# EAGLE schematic PWM sheild d1 mini v1 (EAGLE 9.6.2)
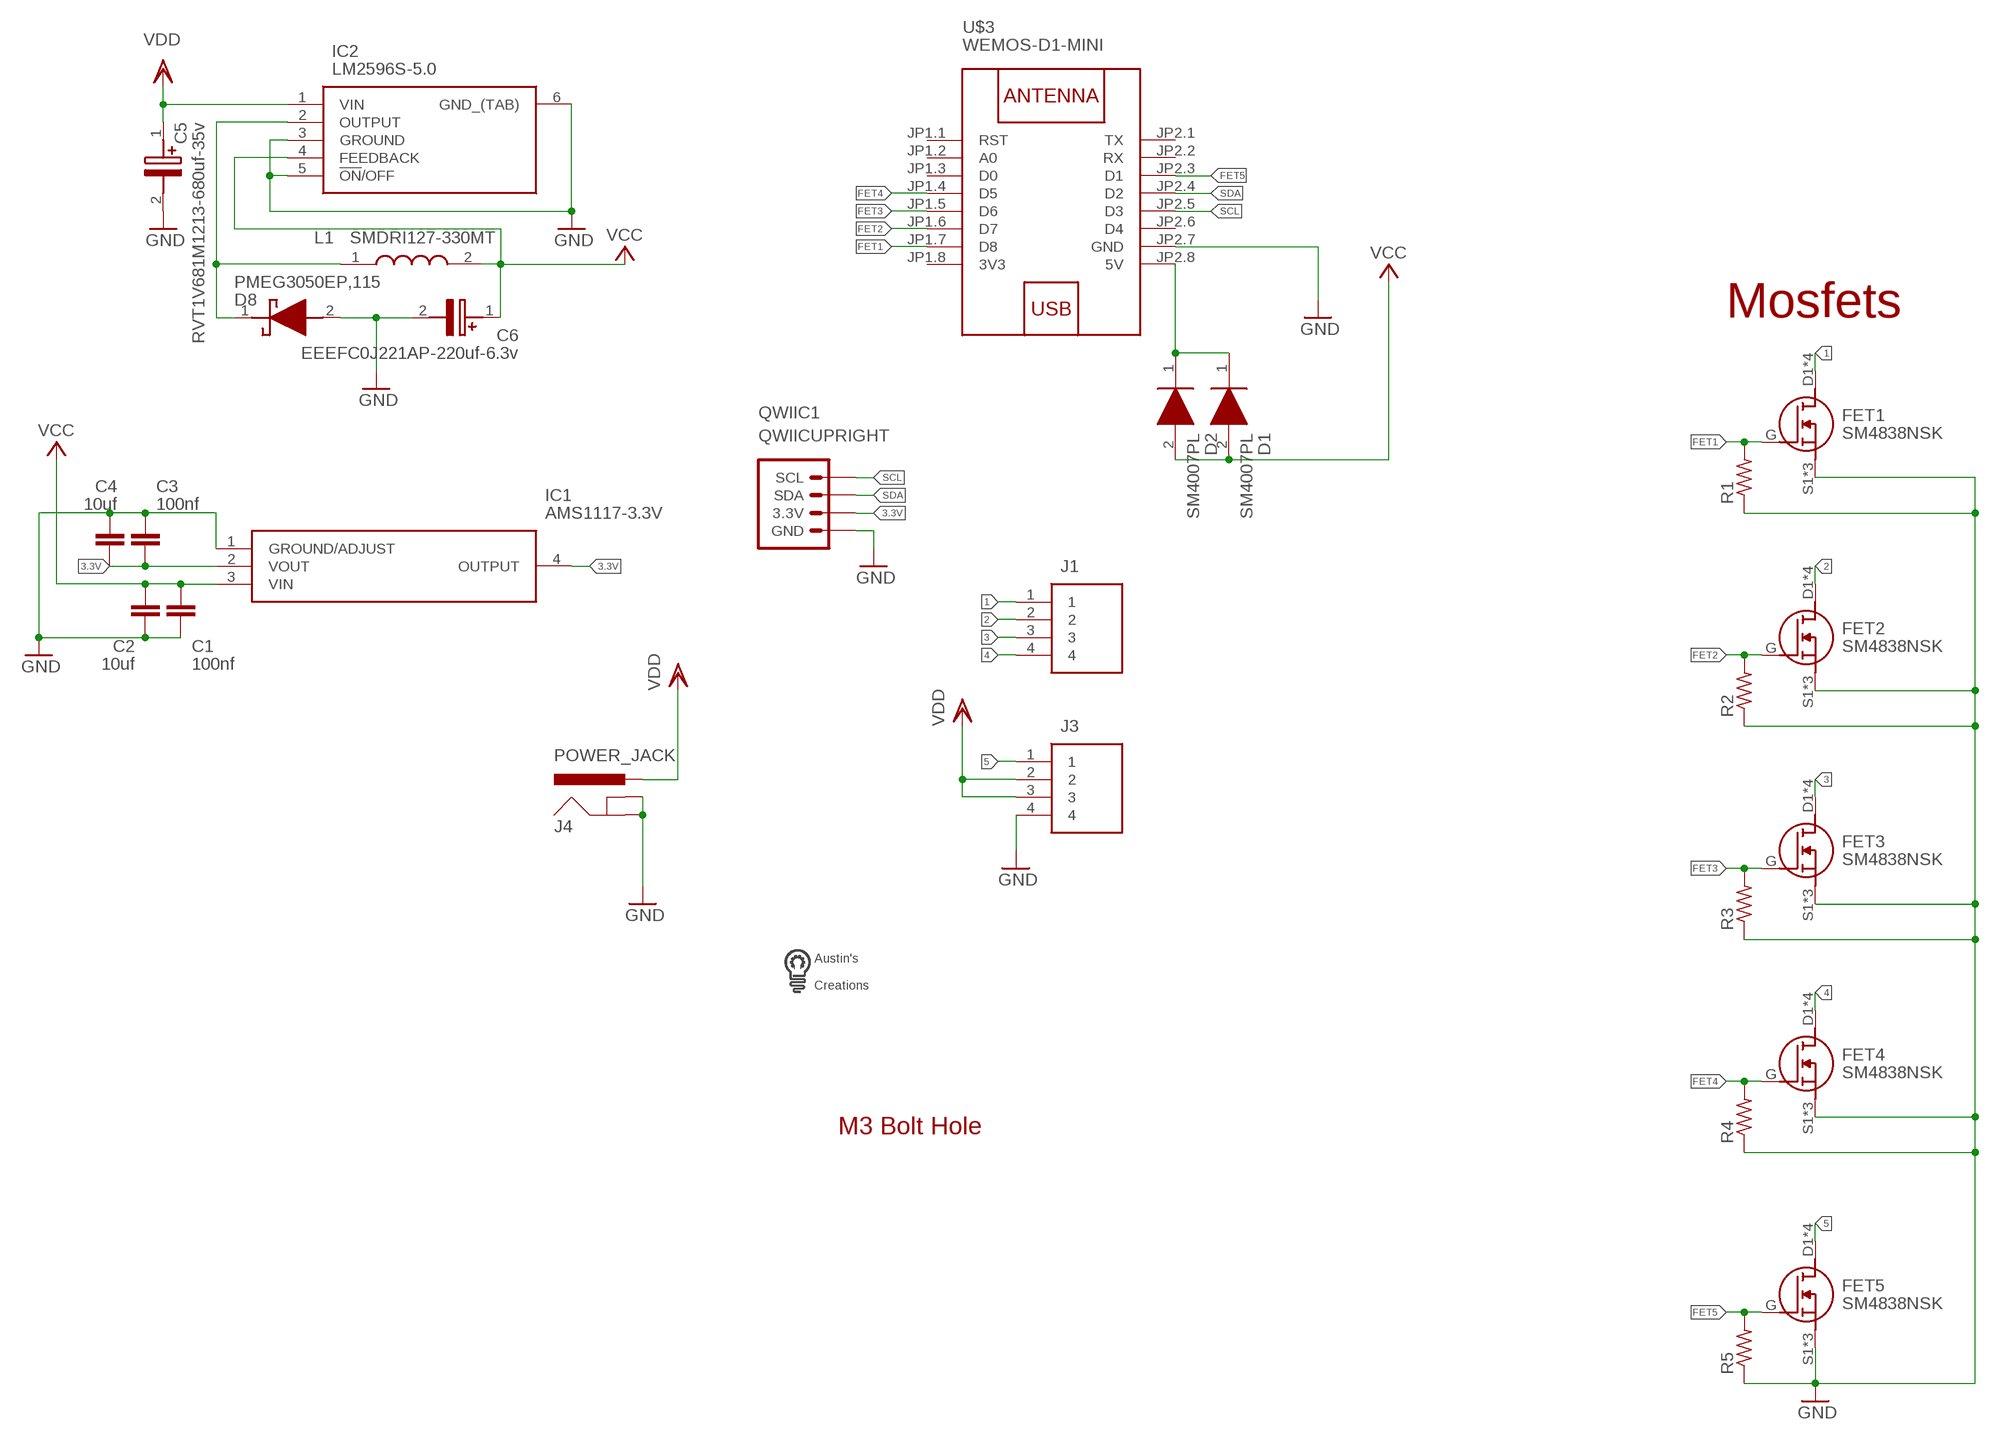
[diagram p0: schematic, sheet 1]

## Parts
C1  100nf  C-EUC0603  [C0603]
C2  10uf  C-EUC0603  [C0603]
C3  100nf  C-EUC0603  [C0603]
C4  10uf  C-EUC0603  [C0603]
C5  RVT1V681M1213-680uf-35v  EEE-HD1V681AQ  [CAPAE1350X1400N]
C6  EEEFC0J221AP-220uf-6.3v  EEEFC0J221AP  [CAPAE830X650N]
D1  SM4007PL  [SODFL3718X125N]
D2  SM4007PL  [SODFL3718X125N]
D8  PMEG3050EP,115  [PMEG3050EP115]
FET1  SM4838NSK  [SM4838NSK]
FET2  SM4838NSK  [SM4838NSK]
FET3  SM4838NSK  [SM4838NSK]
FET4  SM4838NSK  [SM4838NSK]
FET5  SM4838NSK  [SM4838NSK]
IC1  AMS1117-3.3V  [SOT229P700X180-4N]
IC2  LM2596S-5.0  LM2596S-3.3_NOPB  [TO170P1435X465-6N]
J1  SCREWTERMINAL-4P-5MM  [SCREWTERMINAL-4P-5MM]
J3  SCREWTERMINAL-4P-5MM  [SCREWTERMINAL-4P-5MM]
J4  POWER_JACK  [POWER_JACK_PTH]
L1  SMDRI127-330MT  CDRH127_LDNP-330MC  [INDPM120120X800N]
QWIIC1  QWIICUPRIGHT  [BM04B-SRSS-TB]
R1  R-US_R0603  [R0603]
R2  R-US_R0603  [R0603]
R3  R-US_R0603  [R0603]
R4  R-US_R0603  [R0603]
R5  R-US_R0603  [R0603]
U$1  M3BOLTHOLE  [M3BOLTHOLE]
U$3  WEMOS-D1-MINI  [WEMOS-D1-MINI]
U$4  LOGOMED  [LOGOMED]

## Nets
1: FET1.D1(D) FET1.D2(D) FET1.D3(D) FET1.D4(D) J1.1
2: FET2.D1(D) FET2.D2(D) FET2.D3(D) FET2.D4(D) J1.2
3: FET3.D1(D) FET3.D2(D) FET3.D3(D) FET3.D4(D) J1.3
3.3V: C3.2 C4.2 IC1.2(VOUT) IC1.4(OUTPUT) QWIIC1.2(3.3V)
4: FET4.D1(D) FET4.D2(D) FET4.D3(D) FET4.D4(D) J1.4
5: FET5.D1(D) FET5.D2(D) FET5.D3(D) FET5.D4(D) J3.1
FET1: FET1.G R1.2 U$3.JP1.7(D8)
FET2: FET2.G R2.2 U$3.JP1.6(D7)
FET3: FET3.G R3.2 U$3.JP1.5(D6)
FET4: FET4.G R4.2 U$3.JP1.4(D5)
FET5: FET5.G R5.2 U$3.JP2.3(D1)
GND: C1.2 C2.2 C3.1 C4.1 C5.2(-) C6.2(-) D8.2(A) FET1.S1(S) FET1.S2(S) FET1.S3(S) FET2.S1(S) FET2.S2(S) FET2.S3(S) FET3.S1(S) FET3.S2(S) FET3.S3(S) FET4.S1(S) FET4.S2(S) FET4.S3(S) FET5.S1(S) FET5.S2(S) FET5.S3(S) IC1.1(GROUND/ADJUST) IC2.3(GROUND) IC2.5(!ON!/OFF) IC2.6(GND_(TAB)) J3.4 J4.GND J4.GNDBREAK QWIIC1.1(GND) R1.1 R2.1 R3.1 R4.1 R5.1 U$3.JP2.7(GND)
N$2: D1.1(K) D2.1(K) U$3.JP2.8(5V)
N$20: D8.1(K) IC2.2(OUTPUT) L1.1
SCL: QWIIC1.4(SCL) U$3.JP2.5(D3)
SDA: QWIIC1.3(SDA) U$3.JP2.4(D2)
VCC: C1.1 C2.1 C6.1(+) D1.2(A) D2.2(A) IC1.3(VIN) IC2.4(FEEDBACK) L1.2
VDD: C5.1(+) IC2.1(VIN) J3.2 J3.3 J4.PWR
Unconnected: U$3.JP1.1(RST) U$3.JP1.2(A0) U$3.JP1.3(D0) U$3.JP2.1(TX) U$3.JP2.2(RX) U$3.JP2.6(D4)

## Notes on the sheet
- Mosfets

## Power pins joined to a net without a drawn wire
3V3: U$3.JP1.8(3V3)

## Library data of the parts
C1-C4 = rcl:C-EU: CAPACITOR, European symbol; SPICEPREFIX: C
C5 = SamacSys_Parts:EEE-HD1V681AQ: Aluminium Electrolytic Capacitors - SMD 35VDC 680uF 20% AEC-Q200 Source: Datasheet <https://industrial.panasonic.com/cdbs/www-data/pdf/RDE0000/ABA0000C1166.pdf>; DESCRIPTION: Aluminium Electrolytic Capacitors - SMD 35VDC 680uF 20% AEC-Q200; HEIGHT: 14mm; MANUFACTURER_NAME: Panasonic; MANUFACTURER_PART_NUMBER: EEE-HD1V681AQ; MOUSER_PART_NUMBER: 667-EEE-HD1V681AQ; MOUSER_PRICE-STOCK: https://www.mouser.co.uk/ProductDetail/Panasonic/EEE-HD1V681AQ?qs=w%2Fv1CP2dgqoW7i2Hoqi%252B9w%3D%3D
C6 = SamacSys_Parts:EEEFC0J221AP: PANASONIC - EEEFC0J221AP - SMD Aluminium Electrolytic Capacitor, Radial Can - SMD, 220 F, 6.3 V, EEEFC Series Source: Datasheet <https://industrial.panasonic.com/cdbs/www-data/pdf/RDE0000/ABA0000C1169.pdf>; DESCRIPTION: PANASONIC - EEEFC0J221AP - SMD Aluminium Electrolytic Capacitor, Radial Can - SMD, 220 F, 6.3 V, EEEFC Series; HEIGHT: 6.5mm; MANUFACTURER_NAME: Panasonic; MANUFACTURER_PART_NUMBER: EEEFC0J221AP
D1 D2 = SamacSys_Parts:SM4007PL: 1kV 1A 1.1V @ 1A SOD-123FL Diodes - General Purpose RoHS Source: Datasheet <https://datasheet.lcsc.com/szlcsc/1903051030_MDD-Jiangsu-Yutai-Elec-SM4007PL_C64898.pdf>; DESCRIPTION: 1kV 1A 1.1V @ 1A SOD-123FL Diodes - General Purpose RoHS; HEIGHT: 1.25mm; MANUFACTURER_NAME: MDD(Microdiode Electronics); MANUFACTURER_PART_NUMBER: SM4007PL
D8 = SamacSys_Parts:PMEG3050EP,115: NXP PMEG3050EP,115 SMT Schottky Diode, 30V 5A, 2-Pin SOD-128 Source: Datasheet <https://docs-emea.rs-online.com/webdocs/14cd/0900766b814cd012.pdf>; ARROW_PART_NUMBER: PMEG3050EP,115; ARROW_PRICE-STOCK: https://www.arrow.com/en/products/pmeg3050ep115/nexperia; DESCRIPTION: NXP PMEG3050EP,115 SMT Schottky Diode, 30V 5A, 2-Pin SOD-128; HEIGHT: 1mm; MANUFACTURER_NAME: Nexperia; MANUFACTURER_PART_NUMBER: PMEG3050EP,115; MOUSER_PART_NUMBER: 771-PMEG3050EP115; MOUSER_PRICE-STOCK: https://www.mouser.co.uk/ProductDetail/Nexperia/PMEG3050EP115?qs=GcY6OjH1zdmnjQ%2FhUT5aOA%3D%3D
FET1-FET5 = custom parts:SM4838NSK: N channel mosfet 30v 10a SOP-8
IC1 = SamacSys_Parts:AMS1117-3.3V: 1A LOW DROPOUT VOLTAGE REGULATOR, SOT-223 Source: Datasheet <http://www.advanced-monolithic.com/pdf/ds1117.pdf>; DESCRIPTION: 1A LOW DROPOUT VOLTAGE REGULATOR, SOT-223; HEIGHT: 1.8mm; MANUFACTURER_NAME: Advanced Monolithic Systems; MANUFACTURER_PART_NUMBER: ams1117-3.3v
IC2 = SamacSys_Parts:LM2596S-3.3_NOPB: SIMPLE SWITCHER® 4.5V to 40V, 3A Low Component Count Step-Down Regulator Source: Datasheet <http://www.ti.com/lit/ds/symlink/lm2596.pdf>; DESCRIPTION: SIMPLE SWITCHER&#174; 4.5V to 40V, 3A Low Component Count Step-Down Regulator; HEIGHT: 4.65mm; MANUFACTURER_NAME: Texas Instruments; MANUFACTURER_PART_NUMBER: LM2596S-3.3/NOPB; MOUSER_PART_NUMBER: 926-LM2596S-3.3/NOPB; MOUSER_PRICE-STOCK: https://www.mouser.co.uk/ProductDetail/Texas-Instruments/LM2596S-33-NOPB?qs=X1J7HmVL2ZHsEwG9Q6doow%3D%3D
J1 J3 = SamacSys_Parts:SCREWTERMINAL-4P-5MM: Fixed Terminal Blocks Terminal block, screw type, 5.00, horizontal, 4 poles, CUI Blue, slotted screw, PCB mount Source: Datasheet <https://componentsearchengine.com/Datasheets/1/TB001-500-04BE.pdf>; DESCRIPTION: Fixed Terminal Blocks Terminal block, screw type, 5.00, horizontal, 4 poles, CUI Blue, slotted screw, PCB mount; HEIGHT: 12.9mm; MANUFACTURER_NAME: CUI Inc.; MANUFACTURER_PART_NUMBER: TB001-500-04BE; MOUSER_PART_NUMBER: 490-TB001-500-04BE; MOUSER_PRICE-STOCK: https://www.mouser.co.uk/ProductDetail/CUI-Devices/TB001-500-04BE?qs=vLWxofP3U2xFd1xqNcHXZA%3D%3D
J4 = custom parts:POWER_JACK: Power Jack Connector This is the standard 5.5mm barrel jack for power. The PTH is the most common, proven, reliable, footprint. The Slot footprint only works if the mill layer is transmitted to the PCB fab house so be warned. Here are the connectors we sell at SparkFun: DC Barrel Power Jack/Connector <https://www.sparkfun.com/products/119> (PRT-00119) DC Barrel Power Jack/Connector (SMD) <https://www.sparkfun.com/products/12748> (PRT-12748) DC Barrel Jack Adapter - Breadboard Compatible <https://www.sparkfun.com/products/10811> (PRT-10811) It is used on this SparkFun product (and many, many others): SparkFun RedBoard - Programmed with Arduino <https://www.sparkfun.com/products/12757> (DEV-12757) Also, if you need a mating power supply or connector, please check these out: Wall Adapter Power Supply - 9VDC 650mA <https://www.sparkfun.com/products/298> (TOL-00298) DC Barrel Jack Adapter - Male <https://www.sparkfun.com/products/10287> (PRT-10287); PROD_ID: CONN-08197
L1 = SamacSys_Parts:CDRH127_LDNP-330MC: Fixed Inductors 33uH 3.9A Source: Datasheet <https://products.sumida.com/products/pdf/CDRH127LD.pdf>; DESCRIPTION: Fixed Inductors 33uH 3.9A; HEIGHT: 8mm; MANUFACTURER_NAME: Sumida; MANUFACTURER_PART_NUMBER: CDRH127/LDNP-330MC; MOUSER_PART_NUMBER: 851-CDRH127LDNP330MC; MOUSER_PRICE-STOCK: https://www.mouser.co.uk/ProductDetail/Sumida/CDRH127-LDNP-330MC?qs=rZntyWl5IYHj3wgmnQ0WOg%3D%3D
QWIIC1 = custom parts:QWIIC
R1-R5 = rcl:R-US_: RESISTOR, American symbol; SPICEPREFIX: R
U$1 = custom parts:M3BOLTHOLE
U$3 = diy-modules:WEMOS-D1-MINI: WEMOS D1 mini: Mini Wi-Fi Board based on ESP-8266 device More details can be found here: https://www.wemos.cc/product/d1-mini.html Click here to find device on ebay.com <http://www.ebay.com/sch/wemos+d1+mini+nodemcu>
U$4 = custom parts:LOGOMED